# EAGLE design arm-board-rev1 (EAGLE 6.5.0)

## Sheet 1 of 6: Processor
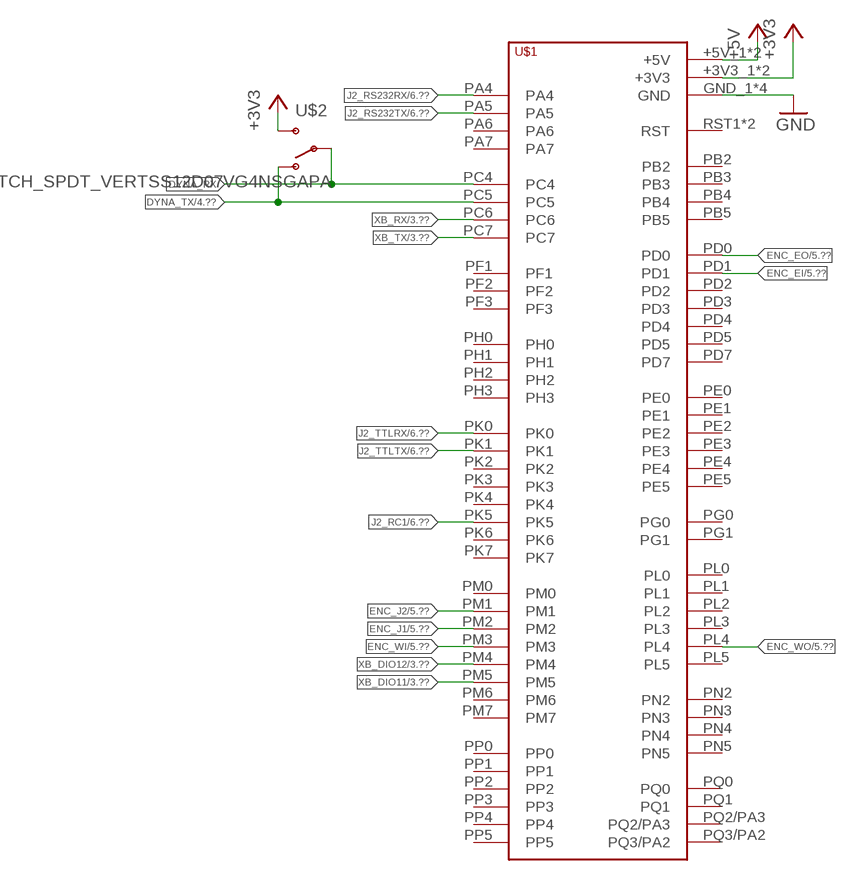
[diagram p0: schematic, sheet 1]

### Parts
U$1  TIVA-C-CONNECTED  [TIVA-C-CONNECTED]
U$2  SWITCH_SPDT_VERTSS12D07VG4NSGAPA  [C&K-SS12D07VG4NSGAPA]

### Nets
+3V3: U$1.+3V3_1(+3V3) U$1.+3V3_2(+3V3) U$2.P$3(S) ; also sheet 3,4,6
+5V: U$1.+5V_1(+5V) U$1.+5V_2(+5V) ; also sheet 2,5
DYNA_RX: U$1.PC4 U$2.P$2(P)
DYNA_TX: U$1.PC5 U$2.P$1(O) ; also sheet 4
ENC_EI: U$1.PD1 ; also sheet 5
ENC_EO: U$1.PD0 ; also sheet 5
ENC_J1: U$1.PM2 ; also sheet 5
ENC_J2: U$1.PM1 ; also sheet 5
ENC_WI: U$1.PM3 ; also sheet 5
ENC_WO: U$1.PL4 ; also sheet 5
GND: U$1.GND_1(GND) U$1.GND_2(GND) U$1.GND_3(GND) U$1.GND_4(GND) ; also sheet 2,3,4,5,6
J2_RC1: U$1.PK5 ; also sheet 6
J2_RS232RX: U$1.PA4 ; also sheet 6
J2_RS232TX: U$1.PA5 ; also sheet 6
J2_TTLRX: U$1.PK0 ; also sheet 6
J2_TTLTX: U$1.PK1 ; also sheet 6
XB_DIO11: U$1.PM5 ; also sheet 3
XB_DIO12: U$1.PM4 ; also sheet 3
XB_RX: U$1.PC6 ; also sheet 3
XB_TX: U$1.PC7 ; also sheet 3
Unconnected: U$1.PA6 U$1.PA7 U$1.PB2 U$1.PB3 U$1.PB4 U$1.PB5 U$1.PD2 U$1.PD3 U$1.PD4 U$1.PD5 U$1.PD7 U$1.PE0 U$1.PE1 U$1.PE2 U$1.PE3 U$1.PE4 U$1.PE5 U$1.PF1 U$1.PF2 U$1.PF3 U$1.PG0 U$1.PG1 U$1.PH0 U$1.PH1 U$1.PH2 U$1.PH3 U$1.PK2 U$1.PK3 U$1.PK4 U$1.PK6 U$1.PK7 U$1.PL0 U$1.PL1 U$1.PL2 U$1.PL3 U$1.PL5 U$1.PM0 U$1.PM6 U$1.PM7 U$1.PN2 U$1.PN3 U$1.PN4 U$1.PN5 U$1.PP0 U$1.PP1 U$1.PP2 U$1.PP3 U$1.PP4 U$1.PP5 U$1.PQ0 U$1.PQ1 U$1.PQ2/PA3 U$1.PQ3/PA2 U$1.RST1(RST) U$1.RST_2(RST)

## Sheet 2 of 6: Power
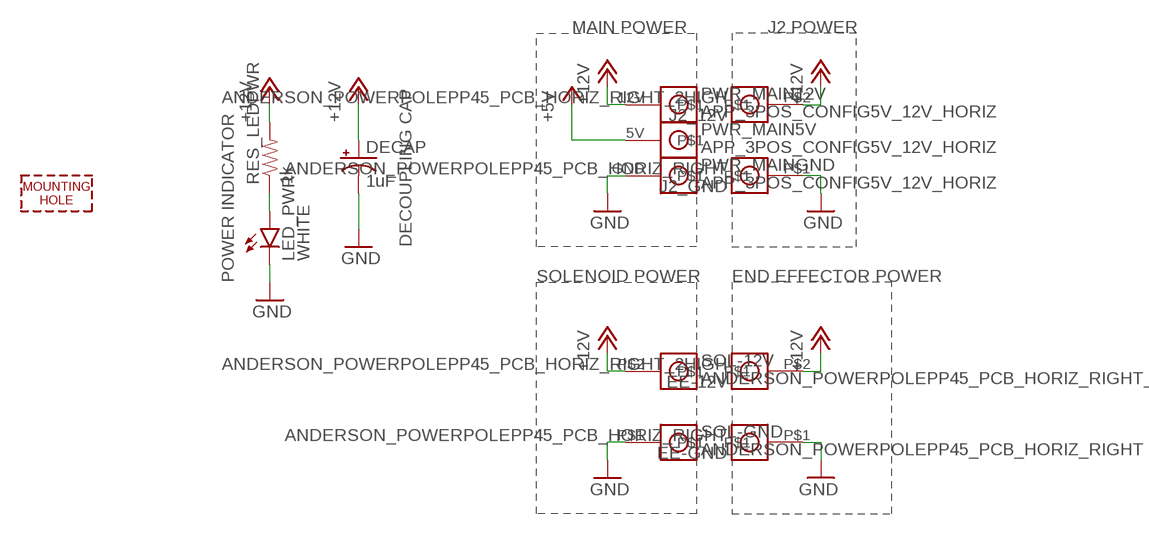
[diagram p1: schematic, sheet 2]

### Parts
DECAP  1uF  100UF-25V-20%(PTH)  [CPOL-RADIAL-100UF-25V]
EE-12V  ANDERSON_POWERPOLEPP45_PCB_HORIZ_RIGHT_2HIGH  [APP45_PCB_HORIZ_RIGHT_2HIGH]
EE-GND  ANDERSON_POWERPOLEPP45_PCB_HORIZ_RIGHT  [APP45_PCB_HORIZ_RIGHT]
H2  MOUNTING_HOLEM6  [M6_SCREW]
J2_12V  ANDERSON_POWERPOLEPP45_PCB_HORIZ_RIGHT_2HIGH  [APP45_PCB_HORIZ_RIGHT_2HIGH]
J2_GND  ANDERSON_POWERPOLEPP45_PCB_HORIZ_RIGHT  [APP45_PCB_HORIZ_RIGHT]
LED_PWR  WHITE  LED1206  [LED-1206]
PWR_MAIN  APP_3POS_CONFIG5V_12V_HORIZ  [APP45_5V_12V_HORIZ_CONFIG]
RES_LEDPWR  1k  RESISTOR1206  [1206]
SOL-12V  ANDERSON_POWERPOLEPP45_PCB_HORIZ_RIGHT_2HIGH  [APP45_PCB_HORIZ_RIGHT_2HIGH]
SOL-GND  ANDERSON_POWERPOLEPP45_PCB_HORIZ_RIGHT  [APP45_PCB_HORIZ_RIGHT]

### Nets
+5V: PWR_MAIN.5V ; also sheet 1,5
+12V: DECAP.1(+) EE-12V.P$2 J2_12V.P$2 PWR_MAIN.12V RES_LEDPWR.2 SOL-12V.P$2 ; also sheet 4
GND: DECAP.2(-) EE-GND.P$1 J2_GND.P$1 LED_PWR.C PWR_MAIN.GND SOL-GND.P$1 ; also sheet 1,3,4,5,6
N$4: LED_PWR.A RES_LEDPWR.1

### Notes on the sheet
- MAIN POWER | J2 POWER
- DECOUPLING CAP
- POWER INDICATOR | SOLENOID POWER | END EFFECTOR POWER

## Sheet 3 of 6: Xbee
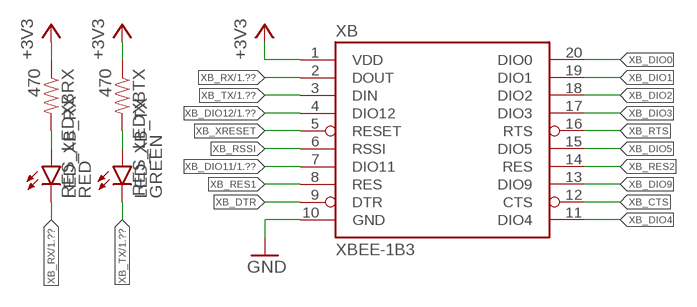
[diagram p2: schematic, sheet 3]

### Parts
LED_XB_RX  RED  LED1206  [LED-1206]
LED_XB_TX  GREEN  LED-GREEN1206  [LED-1206]
RES_LEDXBRX  470  RESISTOR1206  [1206]
RES_LEDXBTX  470  RESISTOR1206  [1206]
XB  XBEE-1B3  [XBEE-SMD]

### Nets
+3V3: RES_LEDXBRX.1 RES_LEDXBTX.1 XB.1(VDD) ; also sheet 1,4,6
GND: XB.10(GND) ; also sheet 1,2,4,5,6
N$1: LED_XB_RX.A RES_LEDXBRX.2
N$2: LED_XB_TX.A RES_LEDXBTX.2
XB_CTS: XB.12(CTS)
XB_DIO0: XB.20(DIO0)
XB_DIO1: XB.19(DIO1)
XB_DIO2: XB.18(DIO2)
XB_DIO3: XB.17(DIO3)
XB_DIO4: XB.11(DIO4)
XB_DIO5: XB.15(DIO5)
XB_DIO9: XB.13(DIO9)
XB_DIO11: XB.7(DIO11) ; also sheet 1
XB_DIO12: XB.4(DIO12) ; also sheet 1
XB_DTR: XB.9(DTR)
XB_RES1: XB.8(RES)
XB_RES2: XB.14(RES)
XB_RSSI: XB.6(RSSI)
XB_RTS: XB.16(RTS)
XB_RX: LED_XB_RX.C XB.2(DOUT) ; also sheet 1
XB_TX: LED_XB_TX.C XB.3(DIN) ; also sheet 1
XB_XRESET: XB.5(RESET)

## Sheet 4 of 6: Dynamixels
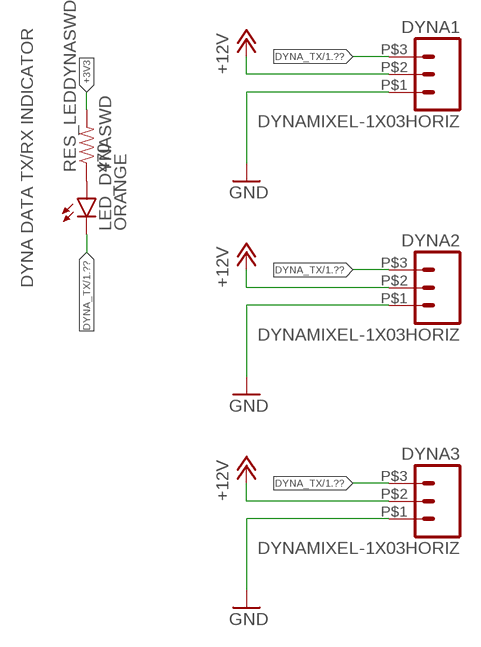
[diagram p3: schematic, sheet 4]

### Parts
DYNA1  DYNAMIXEL-1X03HORIZ  [MLX-SPOX5268-3PIN]
DYNA2  DYNAMIXEL-1X03HORIZ  [MLX-SPOX5268-3PIN]
DYNA3  DYNAMIXEL-1X03HORIZ  [MLX-SPOX5268-3PIN]
LED_DYNASWD  ORANGE  LED1206  [LED-1206]
RES_LEDDYNASWD  470  RESISTOR1206  [1206]

### Nets
+3V3: RES_LEDDYNASWD.2 ; also sheet 1,3,6
+12V: DYNA1.P$2 DYNA2.P$2 DYNA3.P$2 ; also sheet 2
DYNA_TX: DYNA1.P$3 DYNA2.P$3 DYNA3.P$3 LED_DYNASWD.C ; also sheet 1
GND: DYNA1.P$1 DYNA2.P$1 DYNA3.P$1 ; also sheet 1,2,3,5,6
N$3: LED_DYNASWD.A RES_LEDDYNASWD.1

### Notes on the sheet
- DYNA DATA TX/RX INDICATOR

## Sheet 5 of 6: Encoders
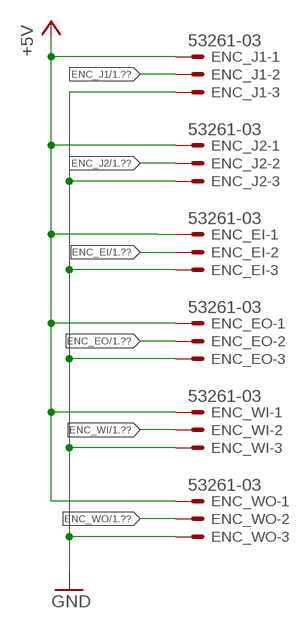
[diagram p4: schematic, sheet 5]

### Parts
ENC_EI  53261-03  [53261-03]
ENC_EO  53261-03  [53261-03]
ENC_J1  53261-03  [53261-03]
ENC_J2  53261-03  [53261-03]
ENC_WI  53261-03  [53261-03]
ENC_WO  53261-03  [53261-03]

### Nets
+5V: ENC_EI.1 ENC_EO.1 ENC_J1.1 ENC_J2.1 ENC_WI.1 ENC_WO.1 ; also sheet 1,2
ENC_EI: ENC_EI.2 ; also sheet 1
ENC_EO: ENC_EO.2 ; also sheet 1
ENC_J1: ENC_J1.2 ; also sheet 1
ENC_J2: ENC_J2.2 ; also sheet 1
ENC_WI: ENC_WI.2 ; also sheet 1
ENC_WO: ENC_WO.2 ; also sheet 1
GND: ENC_EI.3 ENC_EO.3 ENC_J1.3 ENC_J2.3 ENC_WI.3 ENC_WO.3 ; also sheet 1,2,3,4,6

## Sheet 6 of 6: J2
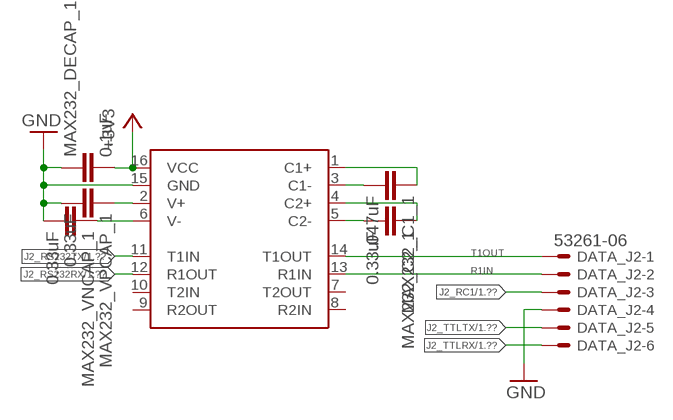
[diagram p5: schematic, sheet 6]

### Parts
DATA_J2  53261-06  [53261-06]
MAX232_1  MAX3232SO16  [SO16]
MAX232_C1_1  .047uF  CAP1206  [1206]
MAX232_C2_1  0.33uF  CAP1206  [1206]
MAX232_DECAP_1  0.1uF  CAP1206  [1206]
MAX232_VNCAP_1  0.33uF  CAP1206  [1206]
MAX232_VPCAP_1  0.33uF  CAP1206  [1206]

### Nets
+3V3: MAX232_1.16(VCC) MAX232_DECAP_1.2 ; also sheet 1,3,4
GND: DATA_J2.4 MAX232_1.15(GND) MAX232_DECAP_1.1 MAX232_VNCAP_1.2 MAX232_VPCAP_1.2 ; also sheet 1,2,3,4,5
J2_RC1: DATA_J2.3 ; also sheet 1
J2_RS232RX: MAX232_1.12(R1OUT) ; also sheet 1
J2_RS232TX: MAX232_1.11(T1IN) ; also sheet 1
J2_TTLRX: DATA_J2.6 ; also sheet 1
J2_TTLTX: DATA_J2.5 ; also sheet 1
N$1_1: MAX232_1.1(C1+) MAX232_C1_1.1
N$2_1: MAX232_1.2(V+) MAX232_VPCAP_1.1
N$3_1: MAX232_1.3(C1-) MAX232_C1_1.2
N$4_1: MAX232_1.4(C2+) MAX232_C2_1.1
N$5_1: MAX232_1.5(C2-) MAX232_C2_1.2
N$6_1: MAX232_1.6(V-) MAX232_VNCAP_1.1
R1IN: DATA_J2.2 MAX232_1.13(R1IN)
T1OUT: DATA_J2.1 MAX232_1.14(T1OUT)
Unconnected: MAX232_1.7(T2OUT) MAX232_1.8(R2IN) MAX232_1.9(R2OUT) MAX232_1.10(T2IN)

## Library data of the parts
DATA_J2 = con-molex:53?-06: CONNECTOR wire to board 1.25 mm (.049 inch) pitch header; OC_FARNELL: 1125375; OC_NEWARK: unknown
DECAP = SparkFun-Capacitors:100UF-25V-20%(PTH): CAP-08439; PROD_ID: CAP-08439
DYNA1-DYNA3 = MRDT-2015-Arm:DYNAMIXEL-1X03; MFR: Molex; MFR_PN: 0022057035; ORIENT: Horiz
EE-12V EE-GND J2_12V J2_GND SOL-12V SOL-GND = MRDT-Connectors:ANDERSON_POWERPOLE: http://www.powerwerx.com/anderson-powerpoles/
ENC_EI ENC_EO ENC_J1 ENC_J2 ENC_WI ENC_WO = con-molex:53?-03: CONNECTOR wire to board 1.25 mm (.049 inch) pitch header; MF: MOLEX; MPN: 53261-0390; OC_FARNELL: 1125359; OC_NEWARK: 57H5006
H2 = MRDT-Hardware:MOUNTING_HOLE: Mounting hole for M6 bolt. Standard use mounting hole for: Tiva C Connected - M6 Anderson Powerpole Mounting Wing - M8 Most frame-mounted PCB's - M8
LED_DYNASWD LED_PWR LED_XB_RX = SparkFun-LED:LED: LEDs Standard schematic elements and footprints for 5mm, 3mm, 1206, and 0603 sized LEDs. 5mm - Spark Fun Electronics SKU : COM-00529 (and others)
LED_XB_TX = SparkFun-LED:LED-GREEN: Various green LEDs Green LEDs used in SFE Production 0603- DIO-00821 LARGE- DIO-00862 LILYPAD- DIO-09910; PROD_ID: DIO-00862
MAX232_1 = MRDT-Digital-ICs:MAX3232: MAX3232 RS232 Transceiver http://pdfserv.maximintegrated.com/en/ds/MAX3222-MAX3241.pdf
MAX232_C1_1 MAX232_C2_1 MAX232_DECAP_1 MAX232_VNCAP_1 MAX232_VPCAP_1 = SparkFun-Capacitors:CAP: Capacitor Standard 0603 ceramic capacitor, and 0.1" leaded capacitor.
PWR_MAIN = MRDT-Connectors:APP_3POS_CONFIG; COLOR1: YELLOW; COLOR2: RED; COLOR3: BLACK
RES_LEDDYNASWD = SparkFun-Resistors:RESISTOR: Resistor Basic schematic elements and footprints for 0603, 1206, and PTH resistors.
RES_LEDPWR RES_LEDXBRX RES_LEDXBTX = SparkFun-Passives:RESISTOR: Resistor Basic schematic elements and footprints for 0603, 1206, and PTH resistors.
U$1 = MRDT-2015-General:TIVA-C-CONNECTED: TIVA C CONNECTED LAUNCHPAD
U$2 = MRDT-Electromechanical:SWITCH_SPDT_VERT
XB = SparkFun:XBEE-1

## Board
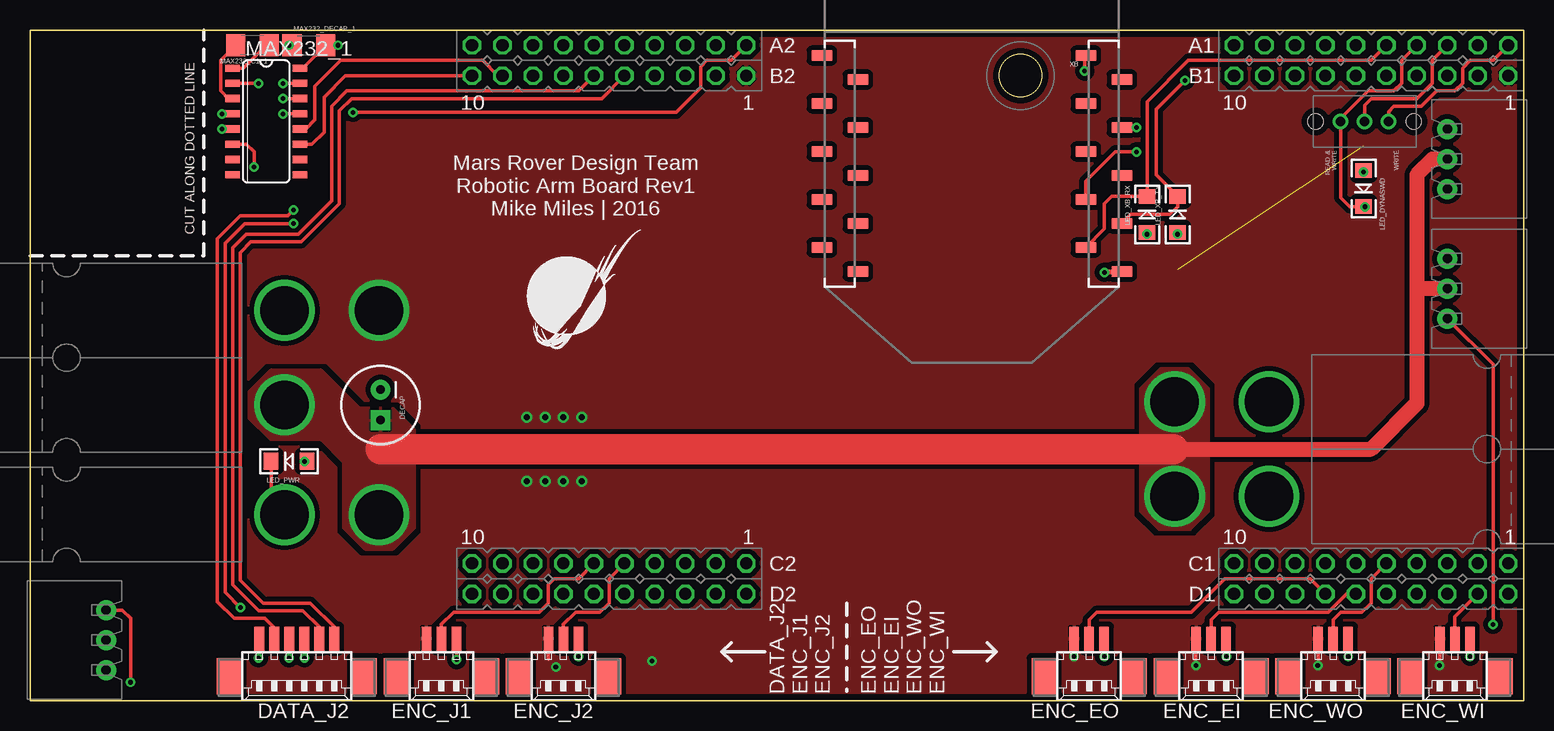
[diagram p6: board, top side]
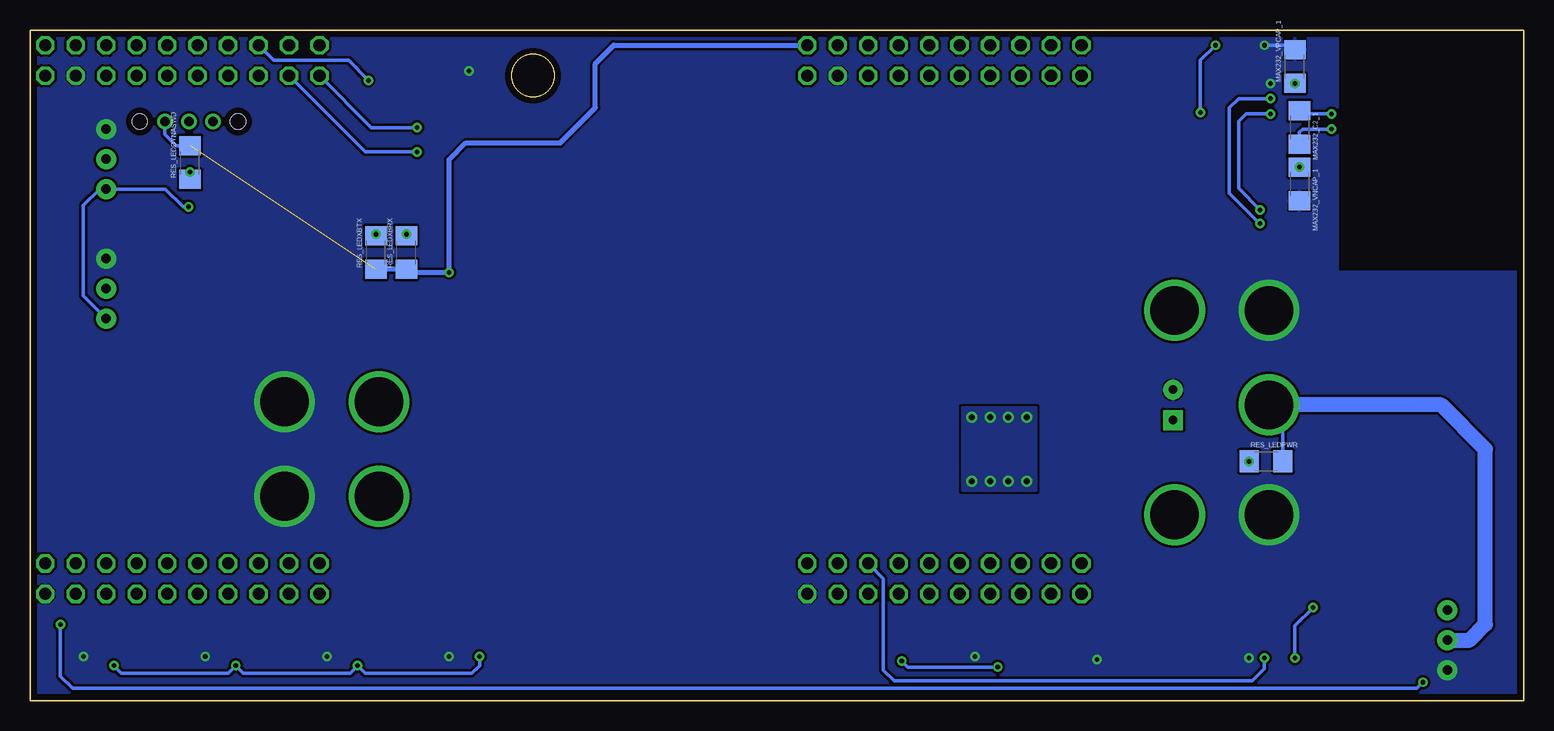
[diagram p7: board, bottom side, seen from below]

Size 124.46 x 55.88 mm. Coordinates in mm from the lower left corner, seen from the top.
Outline: 124.46,55.88 124.46,0 0,0 0,55.88 124.46,55.88
Copper layers (1*16): Top 0.035mm / dielectric 1.5mm / Bottom 0.035mm
Design rules "default *": minimum track width 10mil, minimum drill 15mil, track to track 8mil, track to pad 8mil, pad to pad 8mil, via to via 8mil, smd to smd 5mil, copper to edge 20mil, drill to drill 8mil, minimum pad ring 10mil, minimum via ring 8mil, stop-mask expansion 4mil, vias tented up to drill 0mil, thermal gap 5mil
tKeepout: area 0,35.9 to 15.2,55.9
bKeepout: area 0,35.9 to 15.2,55.9
tRestrict: area 0,35.9 to 15.2,55.9
bRestrict: area 0,35.9 to 15.2,55.9
vRestrict: area 0,35.9 to 15.2,55.9

### Footprints (pad centres in the part's own frame; a part is rotated, then mirrored left to right if it is on the bottom)
53261-06 = smd 0.8 x 2: 1 3.125,-2.5; 2 1.875,-2.5; 3 0.625,-2.5; 4 -0.625,-2.5; 5 -1.875,-2.5; 6 -3.125,-2.5 | smd 2.1 x 3: S1 5.625,0.625; S2 -5.625,0.625
CPOL-RADIAL-100UF-25V = drill 0.7 pad 1.651 square: 1 1.27,0 | drill 0.7 pad 1.651: 2 -1.27,0
MLX-SPOX5268-3PIN = drill 0.8 pad 1.676: P$1 0,0; P$2 2.5,0; P$3 5,0
APP45_PCB_HORIZ_RIGHT_2HIGH = drill 4.064: P$2 36.068,3.937
APP45_PCB_HORIZ_RIGHT = drill 4.064: P$1 28.194,3.937
53261-03 = smd 0.8 x 2: 1 1.25,-2.5; 2 0,-2.5; 3 -1.25,-2.5 | smd 2.1 x 3: S1 3.75,0.625; S2 -3.75,0.625
LED-1206 = smd 1.2 x 1.4: A -1.5,0; C 1.5,0
SO16 = smd 0.6 x 1.2: 1 -4.445,-2.8; 2 -3.175,-2.8; 3 -1.905,-2.8; 4 -0.635,-2.8; 5 0.635,-2.8; 6 1.905,-2.8; 7 3.175,-2.8; 8 4.445,-2.8; 9 4.445,2.8; 10 3.175,2.8; 11 1.905,2.8; 12 0.635,2.8; 13 -0.635,2.8; 14 -1.905,2.8; 15 -3.175,2.8; 16 -4.445,2.8
1206 = smd 1.6 x 1.8: 1 -1.4,0; 2 1.4,0
APP45_5V_12V_HORIZ_CONFIG = drill 4.064: 5V 36.068,3.937; 12V 28.194,-3.937; GND 28.194,3.937
TIVA-C-CONNECTED = drill 1.016 octagon: +3V3_1 59.69,54.61; +3V3_2 123.19,54.61; +5V_1 59.69,52.07; +5V_2 123.19,52.07; GND_1 57.15,52.07; GND_2 59.69,8.89; GND_3 120.65,52.07; GND_4 123.19,8.89; PA4 39.37,52.07; PA5 36.83,52.07; PA6 105.41,52.07; PA7 52.07,8.89; PB2 102.87,54.61; PB3 100.33,54.61; PB4 54.61,52.07; PB5 52.07,52.07; PC4 118.11,54.61; PC5 115.57,54.61; PC6 113.03,54.61; PC7 105.41,54.61; PD0 107.95,8.89; PD1 110.49,8.89; PD2 57.15,54.61; PD3 107.95,54.61; PD4 49.53,54.61; PD5 46.99,54.61; PD7 107.95,52.07; PE0 118.11,52.07; PE1 115.57,52.07; PE2 113.03,52.07; PE3 110.49,52.07; PE4 120.65,54.61; PE5 110.49,54.61; PF1 123.19,11.43; PF2 120.65,11.43; PF3 118.11,11.43; PG0 115.57,11.43; PG1 59.69,11.43; PH0 44.45,11.43; PH1 41.91,11.43; PH2 118.11,8.89; PH3 115.57,8.89; PK0 49.53,52.07; PK1 46.99,52.07; PK2 44.45,52.07; PK3 41.91,52.07; PK4 57.15,11.43; PK5 54.61,11.43; PK6 39.37,11.43; PK7 36.83,11.43; PL0 107.95,11.43; PL1 105.41,11.43; PL2 102.87,11.43; PL3 100.33,11.43; PL4 113.03,11.43; PL5 110.49,11.43; PM0 52.07,11.43; PM1 49.53,11.43; PM2 46.99,11.43; PM3 120.65,8.89; PM4 102.87,52.07; PM5 100.33,52.07; PM6 36.83,8.89; PM7 57.15,8.89; PN2 105.41,8.89; PN3 102.87,8.89; PN4 36.83,54.61; PN5 39.37,54.61; PP0 54.61,54.61; PP1 52.07,54.61; PP2 100.33,8.89; PP3 41.91,8.89; PP4 41.91,54.61; PP5 54.61,8.89; PQ0 44.45,54.61; PQ1 39.37,8.89; PQ2/PA3 46.99,8.89; PQ3/PA2 44.45,8.89; RST1 49.53,8.89; RST_2 113.03,8.89
C&K-SS12D07VG4NSGAPA = drill 0.8: P$1 0,0; P$2 2,0; P$3 4,0 | hole 1.25: -2.1,0; 6.1,0
XBEE-SMD = smd 1.7 x 0.85: 1 -12.5,20; 2 -9.5,18; 3 -12.5,16; 4 -9.5,14; 5 -12.5,12; 6 -9.5,10; 7 -12.5,8; 8 -9.5,6; 9 -12.5,4; 10 -9.5,2; 11 12.5,2; 12 9.5,4; 13 12.5,6; 14 9.5,8; 15 12.5,10; 16 9.5,12; 17 12.5,14; 18 9.5,16; 19 12.5,18; 20 9.5,20

### Placement (x,y rotation side)
DATA_J2  22.23,2.67 180 top
DECAP  29.21,24.64 270 top
DYNA1  6.35,2.54 90 top
DYNA2  118.11,47.62 270 top
DYNA3  118.11,36.83 270 top
EE-12V  131.44,28.83 180 top
EE-GND  131.44,28.83 180 top
ENC_EI  98.42,2.67 180 top
ENC_EO  88.27,2.67 180 top
ENC_J1  34.29,2.67 180 top
ENC_J2  44.45,2.67 180 top
ENC_WI  118.75,2.67 180 top
ENC_WO  108.58,2.67 180 top
H2  82.55,52.07 0 top
J2_12V  -6.99,11.56 0 top
J2_GND  -6.99,11.56 0 top
LED_DYNASWD  111.12,42.67 270 top
LED_PWR  21.59,19.94 180 top
LED_XB_RX  93.09,40.51 90 top
LED_XB_TX  95.63,40.51 90 top
MAX232_1  19.68,48.26 270 top
MAX232_C1_1  18.54,54.61 180 top
MAX232_C2_1  18.67,47.75 270 bottom
MAX232_DECAP_1  23.24,54.61 0 top
MAX232_VNCAP_1  18.67,43.05 270 bottom
MAX232_VPCAP_1  19.05,52.83 90 bottom
PWR_MAIN  -6.99,28.57 0 top
RES_LEDDYNASWD  111.12,44.83 90 bottom
RES_LEDPWR  21.46,19.94 0 bottom
RES_LEDXBRX  93.09,37.34 90 bottom
RES_LEDXBTX  95.63,37.34 90 bottom
SOL-12V  131.44,20.95 180 top
SOL-GND  131.44,20.95 180 top
U$1  0,0 0 top
U$2  109.22,48.26 0 top
U$3  [MRDT_LOGO]  41.4,28.45 0 top
XB  78.49,55.75 180 top

### Tracks (layer width: path | path; a pad name or v marks a point on that pad's centre or on a via)
+3V3  (via drill 0.38)  (1 unrouted)
  Top 0.305: U$2.P$3 113.22,49.09 113.67,49.53 115.95,49.53 117.22,50.8 118.75,50.8 119.38,51.44 119.38,52.7 120.02,53.34 121.92,53.34 U$1.+3V3_2 | MAX232_1.16 22.74,52.7 MAX232_DECAP_1.2 v25.65,54.61 | U$1.+3V3_1 58.42,53.34 56.39,53.34 55.88,52.83 55.88,51.05 53.85,49.02 v26.92,49.02
  Top 0.406: v89.53,35.69 89.6,35.75 XB.1
  Bottom 0.305: U$2.P$3 113.22,47.18 112.27,46.23 RES_LEDDYNASWD.2 | v26.92,49.02 26.92,53.34 v25.65,54.61
  Bottom 0.406: RES_LEDXBTX.1 93.47,35.94 93.47,36.32 RES_LEDXBRX.1 93.09,35.69 v89.53,35.69 89.53,45.09 88.14,46.48 80.26,46.48 77.34,49.4 77.34,53.09 75.82,54.61 U$1.+3V3_1
+5V  (via drill 0.38, 0.5)
  Top 0.305: ENC_EO.1 87.02,3.7 v87,3.68 | v97.16,2.92 97.16,5.66 ENC_EI.1 | ENC_WO.1 107.33,2.94 v107.31,2.92 | ENC_WI.1 117.47,5.66 v117.47,2.92 | ENC_J2.1 43.2,3.45 | v51.82,3.3 51.82,3.56
  Bottom 0.305: v87,3.68 87,2.92 87.63,2.29 96.52,2.29 v97.16,2.92 97.79,2.29 106.68,2.29 v107.31,2.92 107.95,2.29 116.84,2.29 v117.47,2.92 | v43.81,2.79 51.31,2.79 v51.82,3.3
  other vias: 41.4,23.62 42.93,23.62 44.45,23.62 45.97,23.62 41.4,18.29 42.93,18.29 44.45,18.29 45.97,18.29
  pour Top (isolate 0.406, rank 6): -3.17,-3.81 130.81,-3.81 130.81,60.33 -3.17,60.33
  pour Bottom: 40.64,24.38 40.64,17.53 46.74,17.53 46.74,24.38
+12V
  Top 1.27: DYNA2.P$2 116.88,45.12 115.57,43.81 115.57,34.29 | 115.57,34.29 115.57,24.77 111.76,20.95 95.25,20.95 | DYNA3.P$2 115.61,34.33 115.57,34.29
  Top 2.54: 95.25,20.95 29.21,20.95
  Bottom 0.305: RES_LEDPWR.2 20.06,23.49 PWR_MAIN.12V
  Bottom 1.27: DYNA1.P$2 4.49,5.04 3.17,6.35 3.17,20.95 6.86,24.64 PWR_MAIN.12V
  pour Top: 92.58,15.75 92.58,26.04 94.23,27.69 96.52,27.69 98.17,26.04 98.17,15.75 96.65,14.22 94.11,14.22
  pour Top: 24.26,21.72 20.07,21.72 18.29,23.5 18.29,25.78 20.07,27.56 24.26,27.56 27.43,24.38 30.23,24.38 32,22.61 32,14.35 30.23,12.57 27.94,12.57 26.16,14.35 26.16,19.81
DYNA_RX
  Top 0.305: U$2.P$2 111.22,49.62 111.76,50.16 115.57,50.16 116.84,51.44 116.84,53.34 U$1.PC4
DYNA_TX  (via drill 0.38)
  Top 0.305: U$2.P$1 109.22,48.51 111.51,50.8 113.67,50.8 114.3,51.44 114.3,53.34 U$1.PC5 | 109.24,48.24 U$2.P$1 | DYNA1.P$3 7.7,7.54 8.38,6.86 v8.38,1.52 | v121.92,6.35 121.92,28.02 DYNA3.P$3 | U$2.P$1 109.22,41.91 109.98,41.15 111.1,41.15 LED_DYNASWD.C 111.23,41.17 v111.25,41.15
  Bottom 0.305: 118.03,31.75 DYNA3.P$3 120.02,33.73 120.02,41.27 118.67,42.62 DYNA2.P$3 113.18,42.62 111.7,41.15 v111.25,41.15 | v8.38,1.52 8.89,1.02 120.9,1.02 121.92,2.03 v121.92,6.35
ENC_EI
  Top 0.305: U$1.PD1 109.73,8.89 108.2,7.37 99.06,7.37 98.42,6.73 ENC_EI.2
ENC_EO
  Top 0.305: U$1.PD0 106.68,10.16 99.57,10.16 96.77,7.37 88.9,7.37 88.27,6.73 ENC_EO.2
ENC_J1
  Top 0.305: ENC_J1.2 34.29,6.35 35.31,7.37 42.42,7.37 43.18,8.13 43.18,9.65 43.69,10.16 45.72,10.16 U$1.PM2
ENC_J2
  Top 0.305: ENC_J2.2 44.45,6.35 45.47,7.37 47.5,7.37 48.26,8.13 48.26,10.16 U$1.PM1
ENC_WI
  Top 0.305: ENC_WI.2 118.75,6.99 U$1.PM3
ENC_WO
  Top 0.305: U$1.PL4 111.76,10.16 111.76,8.13 111,7.37 109.22,7.37 108.58,6.73 ENC_WO.2
GND  (via drill 0.38)
  Top 0.305: XB.10 87.95,53.72 87.88,53.72 v87.88,52.45 | v99.69,3.68 99.69,5.7 ENC_EI.3 | v109.86,3.68 109.86,5.7 ENC_WO.3 | v120.02,3.68 120.02,5.7 ENC_WI.3 | v89.53,3.68 89.53,5.7 ENC_EO.3 | v45.72,3.68 45.72,5.7 ENC_J2.3 | v35.56,3.43 35.56,5.7 ENC_J1.3 | v22.86,3.56 22.86,5.59 | 22.86,5.59 22.86,5.7 22.84,5.67 | LED_PWR.C 20.09,16.61 J2_GND.P$1 | MAX232_DECAP_1.1 v21.59,54.61 | v21.08,51.44 MAX232_1.15 | DATA_J2.4 22.85,5.58 22.86,5.59
  Bottom 0.305: v21.59,54.61 19.43,54.61 MAX232_VPCAP_1.2
  pour Bottom (rank 6): -18.54,62.99 -18.54,-8.38 127.25,-8.38 127.25,62.99
J2_RC1  (via drill 0.38)
  Top 0.305: DATA_J2.3 v21.6,3.57 v21.59,3.56
  Bottom 0.305: v21.59,3.56 21.59,2.67 22.61,1.65 52.45,1.65 53.34,2.54 53.34,10.16 U$1.PK5
J2_RS232RX
  Top 0.305: U$1.PA4 38.99,52.07 37.72,53.34 25.91,53.34 23.75,51.18 23.75,48.39 22.99,47.62 MAX232_1.12
J2_RS232TX
  Top 0.305: U$1.PA5 26.29,52.07 24.51,50.29 24.51,47.37 23.5,46.35 MAX232_1.11
J2_TTLRX
  Top 0.305: U$1.PK0 47.62,50.16 26.8,50.16 25.78,49.15 25.78,41.4 22.61,38.23 18.41,38.23 17.53,37.34 17.53,10.03 19.43,8.13 23.37,8.13 25.4,6.1 25.4,5.22 DATA_J2.6
J2_TTLTX
  Top 0.305: U$1.PK1 45.72,50.8 26.42,50.8 25.15,49.53 25.15,41.66 22.35,38.86 18.03,38.86 16.89,37.72 16.89,9.65 19.05,7.49 22.73,7.49 24.13,6.1 24.13,5.2 DATA_J2.5
N$1  (via drill 0.38)
  Top 0.406: LED_XB_RX.A v93.09,38.86
  Bottom 0.406: RES_LEDXBRX.2 v93.09,38.86
N$1_1
  Top 0.305: MAX232_C1_1.1 19.68,54.61 17.78,52.7 MAX232_1.1
N$2  (via drill 0.38)
  Top 0.406: LED_XB_TX.A v95.63,38.86
  Bottom 0.406: RES_LEDXBTX.2 v95.63,38.86
N$2_1  (via drill 0.38)
  Top 0.305: MAX232_1.2 v19.05,51.44
  Bottom 0.305: v19.05,51.44 18.55,51.43 MAX232_VPCAP_1.1
N$3  (via drill 0.38)
  Top 0.305: LED_DYNASWD.A v111.12,44.04
  Bottom 0.305: v111.12,44.04 111.13,43.69 RES_LEDDYNASWD.1
N$3_1
  Top 0.305: MAX232_C1_1.2 15.88,53.34 15.88,50.8 16.51,50.16 MAX232_1.3
N$4  (via drill 0.38)
  Top 0.305: LED_PWR.A RES_LEDPWR.1
  Bottom 0.305: RES_LEDPWR.1
  other vias: 22.86,19.94
N$4_1  (via drill 0.38)
  Top 0.305: v16,48.9 MAX232_1.4
  Bottom 0.305: MAX232_C2_1.1 18.41,48.9 v16,48.9
N$5_1  (via drill 0.38)
  Top 0.305: v16,47.62 MAX232_1.5
  Bottom 0.305: MAX232_C2_1.2 18.67,47.37 18.41,47.62 v16,47.62
N$6_1  (via drill 0.38)
  Top 0.305: MAX232_VNCAP_1.1 18.67,45.72 18.03,46.35 MAX232_1.6
  Bottom 0.305: MAX232_VNCAP_1.1
  other vias: 18.67,44.45
R1IN  (via drill 0.38)
  Top 0.305: MAX232_1.13 v21.08,48.9 | v21.97,40.89 21.46,40.39 17.53,40.39 15.62,38.48 15.62,8.26 17.02,6.86 19.56,6.86 20.32,6.1 20.32,5.2 DATA_J2.2
  Bottom 0.305: v21.08,48.9 23.11,48.9 23.75,48.26 23.75,42.67 v21.97,40.89
T1OUT  (via drill 0.38)
  Top 0.305: MAX232_1.14 v21.08,50.16 | v21.97,39.75 17.91,39.75 16.26,38.1 16.26,9.02 v17.53,7.75 | v19.05,3.56 19.1,3.61 DATA_J2.1
  Bottom 0.305: v21.08,50.16 23.75,50.16 24.51,49.4 24.51,42.29 v21.97,39.75 | v17.53,7.75 19.05,6.22 19.05,5.98 19.05,5.88 v19.05,3.56
XB_DIO11  (via drill 0.38)
  Top 0.305: XB.7 90.42,47.75 v92.2,47.75
  Bottom 0.305: v92.2,47.75 96.01,47.75 U$1.PM5
XB_DIO12  (via drill 0.38)
  Top 0.305: XB.4 87.99,43.28 90.42,45.72 v92.2,45.72
  Bottom 0.305: v92.2,45.72 96.52,45.72 U$1.PM4
XB_RX
  Top 0.305: XB.2 89.53,39.3 89.53,41.4 90.15,42.01 LED_XB_RX.C 93.09,49.91 96.52,53.34 111.76,53.34 U$1.PC6
XB_TX  (via drill 0.38)
  Top 0.305: XB.3 91.75,40.51 95,40.51 95.63,41.15 LED_XB_TX.C 95.63,42.04 93.85,43.81 93.85,49.28 v96.27,51.69
  Bottom 0.305: v96.27,51.69 97.92,53.34 104.14,53.34 U$1.PC7

### Text on the board
tPlace: READ & / WRITE / / / / / / / / / WRITE | Mars Rover Design Team / Robotic Arm Board Rev1 / Mike Miles | 2016 | CUT ALONG DOTTED LINE | DATA_J2 / ENC_J1 / ENC_J2 / / ENC_EO / ENC_EI / ENC_WO / ENC_WI